# Altium schematic sheet 8500_ADC.SchDoc
size A4
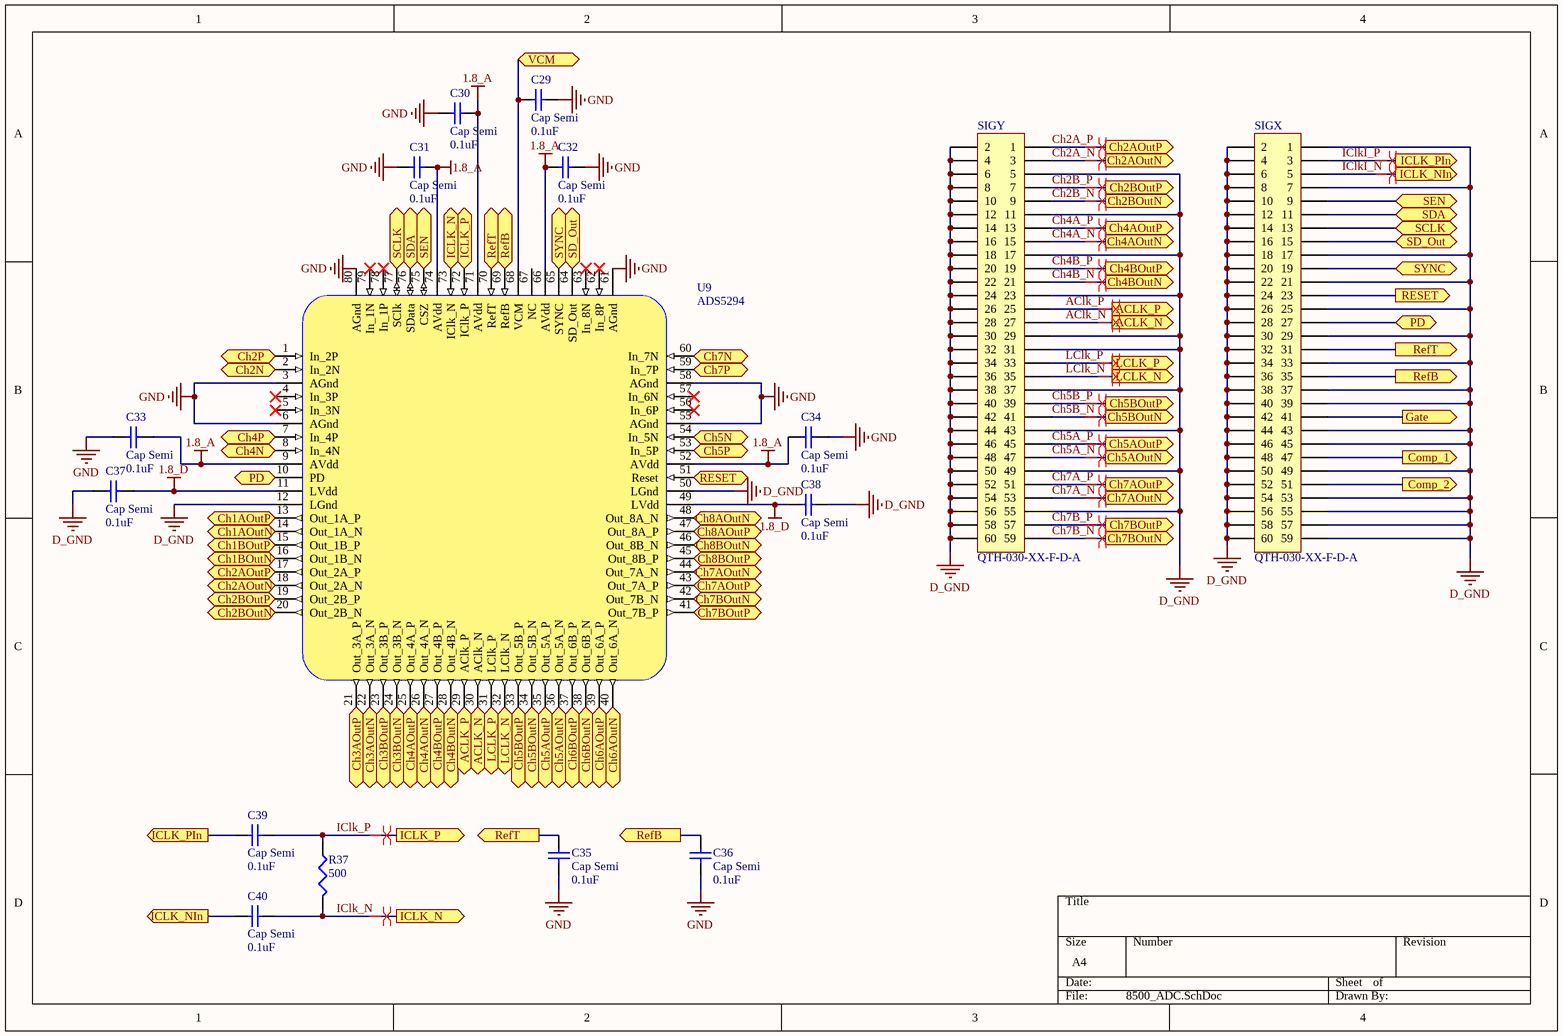
[diagram p0: 8500_ADC.SchDoc]

## Parts
C29  Cap Semi  value 0.1uF  [0402]
C30  Cap Semi  value 0.1uF  [0402]
C31  Cap Semi  value 0.1uF  [0402]
C32  Cap Semi  value 0.1uF  [0402]
C33  Cap Semi  value 0.1uF  [0402]
C34  Cap Semi  value 0.1uF  [0402]
C35  Cap Semi  value 0.1uF  [0402]
C36  Cap Semi  value 0.1uF  [0402]
C37  Cap Semi  value 0.1uF  [0402]
C38  Cap Semi  value 0.1uF  [0402]
C39  Cap Semi  value 0.1uF  [0402]
C40  Cap Semi  value 0.1uF  [0402]
R37  value 500  [0402]  (hidden comment: Res3)
SIGX  QTH-030-XX-F-D-A  [QTH-030-XX-D-A]
SIGY  QTH-030-XX-F-D-A  [QTH-030-XX-D-A]
U9  ADS5294  [PFP80_M]

## Ports
ACLK_N (out), ACLK_P (out), Ch1AOutN (out), Ch1AOutP (out), Ch1BOutN (out), Ch1BOutP (out), Ch2AOutN (out), Ch2AOutP (out), Ch2BOutN (out), Ch2BOutP (out), Ch2N (in), Ch2P (in), Ch3AOutN (out), Ch3AOutP (out), Ch3BOutN (out), Ch3BOutP (out), Ch4AOutN (out), Ch4AOutP (out), Ch4BOutN (out), Ch4BOutP (out), Ch4N (in), Ch4P (in), Ch5AOutN (out), Ch5AOutP (out), Ch5BOutN (out), Ch5BOutP (out), Ch5N (in), Ch5P (in), Ch6AOutN (out), Ch6AOutP (out), Ch6BOutN (out), Ch6BOutP (out), Ch7AOutN (out), Ch7AOutP (out), Ch7BOutN (out), Ch7BOutP (out), Ch7N (in), Ch7P (in), Ch8AOutN (out), Ch8AOutP (out), Ch8BOutN (out), Ch8BOutP (out), Comp_1 (out), Comp_2 (out), Gate (out), ICLK_N (in), ICLK_N (out), ICLK_NIn (out), ICLK_P (in), ICLK_P (out), ICLK_PIn (out), LCLK_N (out), LCLK_P (out), PD, RefB (in), RefB (out), RefT (in), RefT (out), RESET (in), RESET (out), SCLK (bidir), SD_Out, SDA (bidir), SEN (bidir), SYNC (bidir), VCM

## Nets
1.8_A: C30.1 C31.2 C32.1 C33.2 C34.1 U9.9(AVdd) U9.52(AVdd) U9.66(AVdd) U9.71(AVdd) U9.74(AVdd)
1.8_D: C37.2 C38.1 U9.11(LVdd) U9.49(LVdd)
D_GND: C37.1 C38.2 SIGX.1 SIGX.2 SIGX.4 SIGX.6 SIGX.7 SIGX.8 SIGX.10 SIGX.12 SIGX.14 SIGX.16 SIGX.17 SIGX.18 SIGX.20 SIGX.21 SIGX.22 SIGX.24 SIGX.25 SIGX.26 SIGX.28 SIGX.29 SIGX.30 SIGX.32 SIGX.33 SIGX.34 SIGX.36 SIGX.37 SIGX.38 SIGX.39 SIGX.40 SIGX.42 SIGX.43 SIGX.44 SIGX.45 SIGX.46 SIGX.48 SIGX.49 SIGX.50 SIGX.52 SIGX.53 SIGX.54 SIGX.55 SIGX.56 SIGX.57 SIGX.58 SIGX.59 SIGX.60 SIGY.2 SIGY.4 SIGY.5 SIGY.6 SIGY.8 SIGY.10 SIGY.11 SIGY.12 SIGY.14 SIGY.16 SIGY.17 SIGY.18 SIGY.20 SIGY.22 SIGY.23 SIGY.24 SIGY.26 SIGY.28 SIGY.29 SIGY.30 SIGY.31 SIGY.32 SIGY.34 SIGY.36 SIGY.37 SIGY.38 SIGY.40 SIGY.42 SIGY.43 SIGY.44 SIGY.46 SIGY.48 SIGY.49 SIGY.50 SIGY.52 SIGY.54 SIGY.55 SIGY.56 SIGY.58 SIGY.60 U9.12(LGnd) U9.50(LGnd)
GND: C29.1 C30.1 C31.1 C32.2 C33.1 C34.2 C35.2 C36.2 U9.3(AGnd) U9.6(AGnd) U9.55(AGnd) U9.58(AGnd) U9.61(AGnd) U9.80(AGnd)
AClk_N: SIGY.27 U9.30(AClk_N) ; port ACLK_N
AClk_P: SIGY.25 U9.29(AClk_P) ; port ACLK_P
Ch1AOutN: U9.14(Out_1A_N) ; port Ch1AOutN
Ch1AOutP: U9.13(Out_1A_P) ; port Ch1AOutP
Ch1BOutN: U9.16(Out_1B_N) ; port Ch1BOutN
Ch1BOutP: U9.15(Out_1B_P) ; port Ch1BOutP
Ch2A_N: SIGY.3 U9.18(Out_2A_N) ; port Ch2AOutN
Ch2A_P: SIGY.1 U9.17(Out_2A_P) ; port Ch2AOutP
Ch2B_N: SIGY.9 U9.20(Out_2B_N) ; port Ch2BOutN
Ch2B_P: SIGY.7 U9.19(Out_2B_P) ; port Ch2BOutP
Ch2N: U9.2(In_2N) ; port Ch2N
Ch2P: U9.1(In_2P) ; port Ch2P
Ch3AOutN: U9.22(Out_3A_N) ; port Ch3AOutN
Ch3AOutP: U9.21(Out_3A_P) ; port Ch3AOutP
Ch3BOutN: U9.24(Out_3B_N) ; port Ch3BOutN
Ch3BOutP: U9.23(Out_3B_P) ; port Ch3BOutP
Ch4A_N: SIGY.15 U9.26(Out_4A_N) ; port Ch4AOutN
Ch4A_P: SIGY.13 U9.25(Out_4A_P) ; port Ch4AOutP
Ch4B_N: SIGY.21 U9.28(Out_4B_N) ; port Ch4BOutN
Ch4B_P: SIGY.19 U9.27(Out_4B_P) ; port Ch4BOutP
Ch4N: U9.8(In_4N) ; port Ch4N
Ch4P: U9.7(In_4P) ; port Ch4P
Ch5A_N: SIGY.47 U9.36(Out_5A_N) ; port Ch5AOutN
Ch5A_P: SIGY.45 U9.35(Out_5A_P) ; port Ch5AOutP
Ch5B_N: SIGY.41 U9.34(Out_5B_N) ; port Ch5BOutN
Ch5B_P: SIGY.39 U9.33(Out_5B_P) ; port Ch5BOutP
Ch5N: U9.54(In_5N) ; port Ch5N
Ch5P: U9.53(In_5P) ; port Ch5P
Ch6AOutN: U9.40(Out_6A_N) ; port Ch6AOutN
Ch6AOutP: U9.39(Out_6A_P) ; port Ch6AOutP
Ch6BOutN: U9.38(Out_6B_N) ; port Ch6BOutN
Ch6BOutP: U9.37(Out_6B_P) ; port Ch6BOutP
Ch7A_N: SIGY.53 U9.44(Out_7A_N) ; port Ch7AOutN
Ch7A_P: SIGY.51 U9.43(Out_7A_P) ; port Ch7AOutP
Ch7B_N: SIGY.59 U9.42(Out_7B_N) ; port Ch7BOutN
Ch7B_P: SIGY.57 U9.41(Out_7B_P) ; port Ch7BOutP
Ch7N: U9.60(In_7N) ; port Ch7N
Ch7P: U9.59(In_7P) ; port Ch7P
Ch8AOutN: U9.48(Out_8A_N) ; port Ch8AOutN
Ch8AOutP: U9.47(Out_8A_P) ; port Ch8AOutP
Ch8BOutN: U9.46(Out_8B_N) ; port Ch8BOutN
Ch8BOutP: U9.45(Out_8B_P) ; port Ch8BOutP
Comp_1: SIGX.47 ; port Comp_1
Comp_2: SIGX.51 ; port Comp_2
Gate: SIGX.41 ; port Gate
IClk_N: C40.1 R37.2 U9.73(IClk_N) ; port ICLK_N
IClk_P: C39.1 R37.1 U9.72(IClk_P) ; port ICLK_P
IClkI_N: C40.2 SIGX.5 ; port ICLK_NIn
IClkI_P: C39.2 SIGX.3 ; port ICLK_PIn
LClk_N: SIGY.35 U9.32(LClk_N) ; port LCLK_N
LClk_P: SIGY.33 U9.31(LClk_P) ; port LCLK_P
PD: SIGX.27 U9.10(PD) ; port PD
RefB: C36.2 SIGX.35 U9.69(RefB) ; port RefB
RefT: C35.2 SIGX.31 U9.70(RefT) ; port RefT
RESET: SIGX.23 U9.51(Reset) ; port RESET
SCLK: SIGX.13 U9.77(SClk) ; port SCLK
SD_Out: SIGX.15 U9.64(SD_Out) ; port SD_Out
SDA: SIGX.11 U9.76(SData) ; port SDA
SEN: SIGX.9 U9.75(CSZ) ; port SEN
SYNC: SIGX.19 U9.65(SYNC) ; port SYNC
VCM: C29.1 U9.68(VCM) ; port VCM

Not connected (* = marked no-connect by the designer): U9 4(In_3P)* 5(In_3N)* 56(In_6P)* 57(In_6N)* 62(In_8P)* 63(In_8N)* 67(NC) 78(In_1P)* 79(In_1N)*

## Layout directives
differential pair: AClk_N, AClk_P, Ch2A_N, Ch2A_P, Ch2B_N, Ch2B_P, Ch4A_N, Ch4A_P, Ch4B_N, Ch4B_P, Ch5A_N, Ch5A_P, Ch5B_N, Ch5B_P, Ch7A_N, Ch7A_P, Ch7B_N, Ch7B_P, IClk_N, IClk_P, IClkI_N, IClkI_P, LClk_N, LClk_P

## Library data of the parts
C29-C40 = Cap Semi: Capacitor (Semiconductor SIM Model); Published: 8-Jun-2000; LatestRevisionDate: 29-May-2009; LatestRevisionNote: IPC-7351 Footprint Added.; PackageReference: C1206; Publisher: Altium Limited; PackageDescription: Chip Capacitor
R37 = Res3: Resistor; Published: 8-Jun-2000; LatestRevisionDate: 29-May-2009; LatestRevisionNote: IPC-7351 Footprint Added.; PackageReference: J1-0603; Publisher: Altium Limited; PackageDescription: Chip Resistor